# Altium schematic sheet Output_Voltage_Selection_and_Enable.SchDoc
size A4; CompanyName: Technische Hochschule Nürnberg Georg Simon Ohm; Organization: UltraZohm; Address1: Kesslerplatz 12; Address2: 90489 Nürnberg; Address3: GERMANY; DocumentNumber: 5; SheetNumber: 5; SheetTotal: 5; Website: www.ultrazohm.com
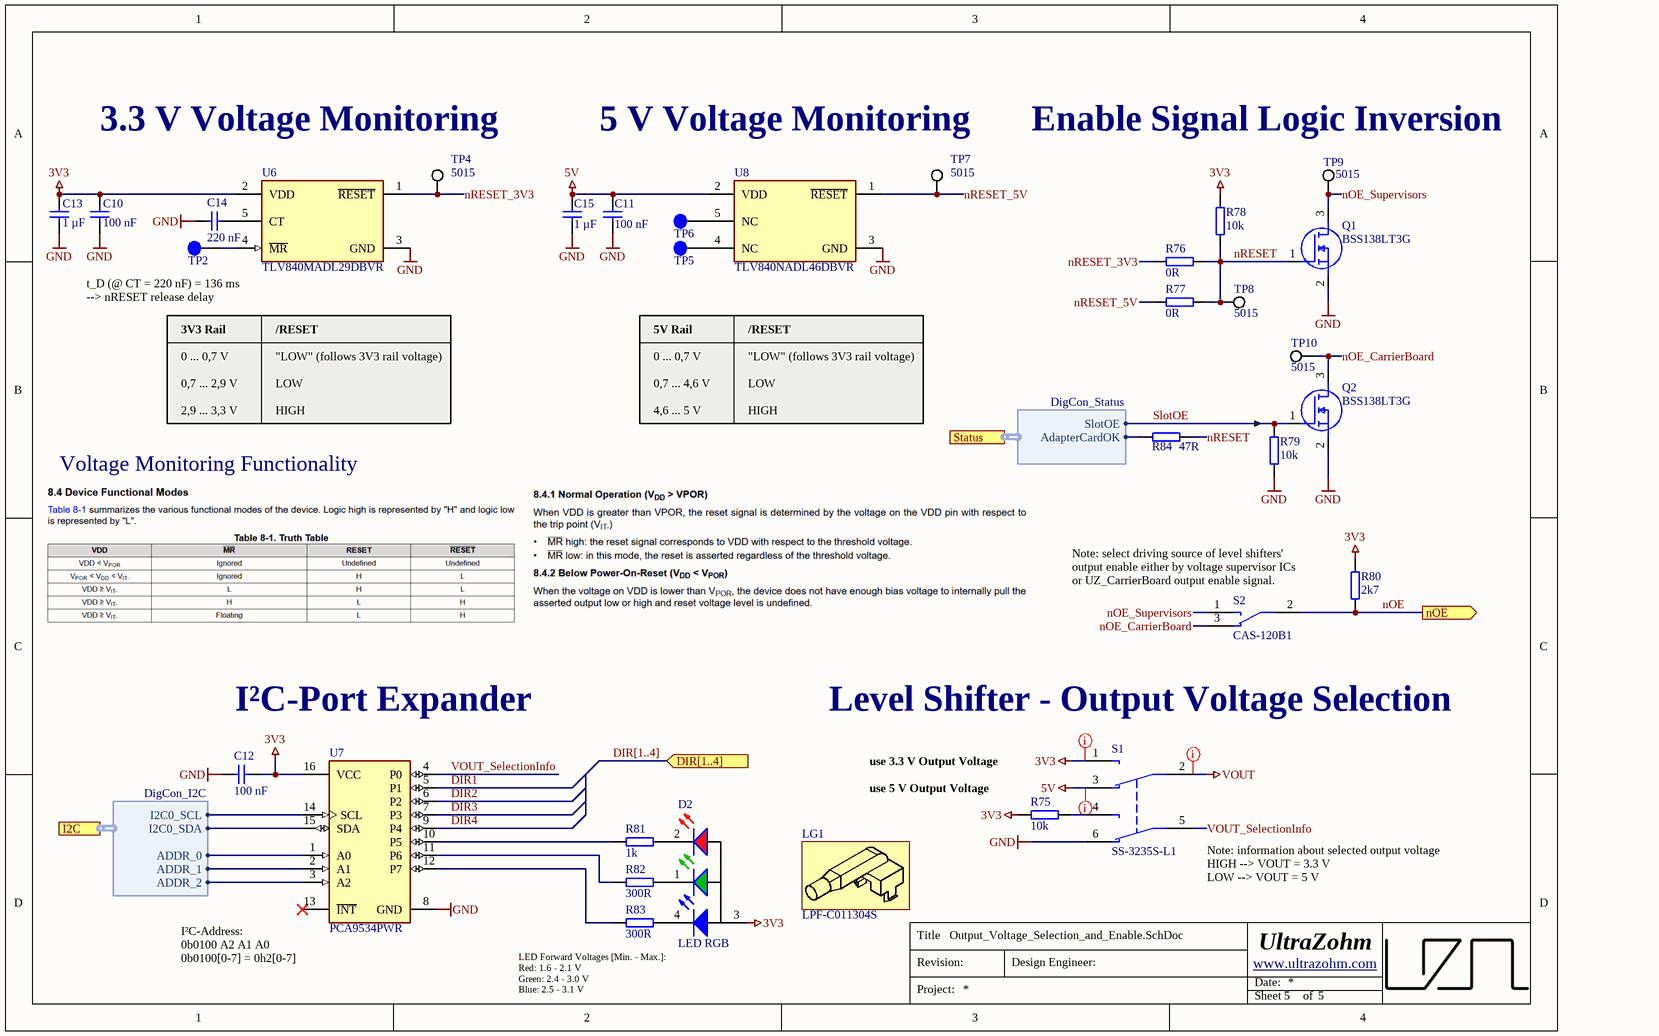
[diagram p0: Output_Voltage_Selection_and_Enable.SchDoc]

## Parts
C10  100 nF  [C_0603_TE]
C11  100 nF  [C_0603_TE]
C12  100 nF  [C_0603_TE]
C13  1 µF  [C_0603_TE]
C14  220 nF  [C_0603_TE]
C15  1 µF  [C_0603_TE]
D2  LED RGB  [LED_1615]
LG1  LPF-C011304S  [LPF-C011304S]
Q1  BSS138LT3G  [SOT-23-3]
Q2  BSS138LT3G  [SOT-23-3]
R75  10k  [R_0603_TE]
R76  0R  [R_0603_TE]
R77  0R  [R_0603_TE]
R78  10k  [R_0603_TE]
R79  10k  [R_0603_TE]
R80  2k7  [R_0603_TE]
R81  1k  [R_0603_TE]
R82  300R  [R_0603_TE]
R83  300R  [R_0603_TE]
R84  47R  [R_0603_TE]
S1  SS-3235S-L1  [SS-3235S-L1]
S2  CAS-120B1  [CAS120B1]
TP2  Testpoint 1mm  [TP_1mm]  (value not drawn)  (no BOM)
TP4  5015  [FP-5015-MFG]
TP5  Testpoint 1mm  [TP_1mm]  (value not drawn)  (no BOM)
TP6  Testpoint 1mm  [TP_1mm]  (value not drawn)  (no BOM)
TP7  5015  [FP-5015-MFG]
TP8  5015  [FP-5015-MFG]
TP9  5015  [FP-5015-MFG]
TP10  5015  [FP-5015-MFG]
U6  TLV840MADL29DBVR  [SOT23-5_DBV]
U7  PCA9534PWR  [TSSOP-16_PW0016A_N]
U8  TLV840NADL46DBVR  [SOT23-5_DBV]

## Ports
DIR[1..4] (in), I2C (harness DigCon_I2C), nOE (out), Status (harness DigCon_Status)

## Harnesses
DigCon_Status: SlotOE, AdapterCardOK
DigCon_I2C: I2C0_SDA, I2C0_SCL, ADDR_0, ADDR_1, ADDR_2

## Nets
3V3: C10.1 C12.2 C13.2 D2.3(A) R75.2 R78.2 R80.2 S1.1(NO1) U6.2(VDD) U7.16(VCC)
5V: C11.1 C15.2 S1.3(NC1) U8.2(VDD)
GND: C10.2 C11.2 C12.1 C13.1 C14.1 C15.1 Q1.2(S) Q2.2(S) R79.1 S1.6(NC2) U6.3(GND) U7.8(GND) U8.3(GND)
VOUT: S1.2(COM1)
DIR1: U7.5(P1)
DIR2: U7.6(P2)
DIR3: U7.7(P3)
DIR4: U7.9(P4)
nOE: R80.1 S2.2(COM1) ; port nOE
nOE_CarrierBoard: Q2.3(D) S2.3(NC1) TP10.1
nOE_Supervisors: Q1.3(D) S2.1(NO1) TP9.1
nRESET: Q1.1(G) R76.2 R77.2 R78.1 R84.2 TP8.1
nRESET_3V3: R76.1 TP4.1 U6.1(~{RESET})
nRESET_5V: R77.1 TP7.1 U8.1(~{RESET})
SlotOE: Q2.1(G) R79.2 ; port Status.SlotOE
VOUT_SelectionInfo: S1.5(COM2) U7.4(P0)
NetC14_2: C14.2 U6.5(CT)
NetD2_1: D2.1(K) R82.2
NetD2_2: D2.2(K) R81.1
NetD2_4: D2.4(K_B) R83.2
NetR75_1: R75.1 S1.4(NO2)
NetR81_2: R81.2 U7.10(P5)
NetR82_1: R82.1 U7.11(P6)
NetR83_1: R83.1 U7.12(P7)
NetR84_1: R84.1 ; port Status.AdapterCardOK
NetTP2_1: TP2.1 U6.4(~{MR})
NetTP5_1: TP5.1 U8.4(NC)
NetTP6_1: TP6.1 U8.5(NC)
NetU7_1: U7.1(A0) ; port I2C.ADDR_0
NetU7_2: U7.2(A1) ; port I2C.ADDR_1
NetU7_3: U7.3(A2) ; port I2C.ADDR_2
NetU7_14: U7.14(SCL) ; port I2C.I2C0_SCL
NetU7_15: U7.15(SDA) ; port I2C.I2C0_SDA

Not connected (* = marked no-connect by the designer): U7 13(~{INT})*

## Buses and harness runs
bus DIR[1..4] = port DIR[1..4]

## Layout directives
mark named PWR: 3V3, 5V, VOUT

## Notes on the sheet
- 3.3 V Voltage Monitoring
- 5 V Voltage Monitoring
- (near TP9) Enable Signal Logic Inversion
- t_D (@ CT = 220 nF) = 136 ms
  --> nRESET release delay
- 3V3 Rail
- 0 ... 0,7 V
- 0,7 ... 2,9 V
- /RESET
- "LOW" (follows 3V3 rail voltage)
- LOW
- 5V Rail
- 0,7 ... 4,6 V
- 2,9 ... 3,3 V
- HIGH
- 4,6 ... 5 V
- Voltage Monitoring Functionality
- (near S2) Note: select driving source of level shifters' output enable either by voltage supervisor ICs or UZ_CarrierBoard output enable signal.
- I²C-Port Expander
- Level Shifter - Output Voltage Selection
- (near R75) use 3.3 V Output Voltage
- (near R75) use 5 V Output Voltage
- (near S1) Note: information about selected output voltage
  HIGH --> VOUT = 3.3 V
  LOW --> VOUT = 5 V
- (near U7) I²C-Address:
  0b0100 A2 A1 A0
  0b0100[0-7] = 0h2[0-7]
- LED Forward Voltages [Min. - Max.]:
  Red: 1.6 - 2.1 V
  Green: 2.4 - 3.0 V
  Blue: 2.5 - 3.1 V
- Title
- Revision:
- Design Engineer:
- Date:
- Project:
- Sheet
- of

## Library data of the parts
C10 C11 = UZgen_C_0603_100nF_50V_X7R: Generic capacitor; Manufacturer: UZgen; Voltage: 50V; Tolerance: 10 %; Created from: AGeiger; Manufacturer Part Number: UZgen_C_0603_100nF_50V_X7R; PartID: 1; Created On: 02.07.2024 14:42:23; Value: 100 nF; Device Package: 0603; Technology: X7R; Mounting Type: SMD; Last Updated: 08.08.2024 15:01:15
C12 = UZgen_C_0603_100nF_50V_X7R: Generic capacitor; Manufacturer: UZgen; Tolerance: 10 %; Created from: AGeiger; Voltage: 50V; Manufacturer Part Number: UZgen_C_0603_100nF_50V_X7R; PartID: 1; Created On: 02.07.2024 14:42:23; Device Package: 0603; Last Updated: 08.08.2024 15:01:15; Mounting Type: SMD; Value: 100 nF; Technology: X7R
C13 C15 = UZgen_C_0603_1uF_16V_X7R: Generic capacitor; Manufacturer: UZgen; Voltage: 16V; Tolerance: 10 %; Created from: UZgenTool; Manufacturer Part Number: UZgen_C_0603_1uF_16V_X7R; PartID: 3783; Created On: 02.08.2024 11:17:59; Value: 1 µF; Device Package: 0603; Technology: X7R; Mounting Type: SMD; Last Updated: 02.08.2024 11:17:59
C14 = UZgen_C_0603_220nF_50V_X7R: Generic capacitor; Manufacturer: UZgen; Voltage: 50V; Tolerance: 10 %; Created from: UZgenTool; Manufacturer Part Number: UZgen_C_0603_220nF_50V_X7R; PartID: 2; Created On: 02.07.2024 14:42:23; Value: 220 nF; Device Package: 0603; Technology: X7R; Mounting Type: SMD; Last Updated: 08.08.2024 15:01:15
D2 = A-SP1943B1GHR6C-C01-2T: RGB LED - SMD 1615; Manufacturer: Amicc; Type: Standard; Created from: AGeiger; Manufacturer Part Number: A-SP1943B1GHR6C-C01-2T; PartID: 31; Created On: 09.09.2024 10:45:01; ComponentLink1Description: Datasheet; ComponentLink1URL: https://www.lcsc.com/datasheet/lcsc_datasheet_2410121631_Amicc-A-SP1943B1GHR6C-C01-2T_C19171342.pdf; Component Type: LED Diode; Device Package: 1615; Last Updated: 09.09.2024 10:45:01; Mounting Type: SMD; Operating Temperature: -40 to +85 °C; Supplier 1: LCSC; Supplier Part Number 1: C19171342; Value: LED RGB; Live Cycle Status: 1; Stock number: not stored; Color: rgb; LCSC Part Number: C19171342
LG1 = LPF-C011304S: LED Light Pipes RA Light Pipe Clr 2.8mm Round; Manufacturer: Lumex; Created from: AGeiger; Manufacturer Part Number: LPF-C011304S; PartID: 54; Created On: 15.07.2024 08:35:38; ComponentLink1Description: Datasheet; ComponentLink1URL: https://www.farnell.com/datasheets/1632591.pdf; Component Type: Light Guide; Device Package: SMD; Last Updated: 22.03.2025 18:11:56; Mounting Type: SMD; Supplier 1: Mouser; Supplier Part Number 1: 696-LPF-C011304S; Type: Lightguide; Value: LPF-C011304S; Live Cycle Status: 1
Q1 Q2 = BSS138LT3G: Power MOSFET, n-Channel, 200 mA, 50 V; Manufacturer: ON Semicondutor; Value: 50 V; Created from: MGremer; Manufacturer Part Number: BSS138LT3G; PartID: 1; Created On: 02.02.2021 13:34:18; ComponentLink1Description: Datasheet; ComponentLink1URL: https://www.mouser.de/datasheet/2/308/BSS138LT1_D-1522521.pdf; Component Type: Power MOSFET; Device Package: SOT-23-3; Last Updated: 28.03.2025 21:09:28; Mounting Type: SMD; Operating Temperature: -55 - 150 °C; Series: BSS138L; Supplier 1: Mouser; Supplier Part Number 1: 863-BSS138LT3G; Type: Power MOSFET; Live Cycle Status: 1; Stock number: not stored; Supplier 2: LCSC; Supplier Part Number 2: C83790; LCSC Part Number: C83790
R75 R78 R79 = UZgen_R_0603_10k: Generic resistor; Manufacturer: UZgen; Tolerance: 1 %; Created from: AGeiger; Manufacturer Part Number: UZgen_R_0603_10k; PartID: 1; Created On: 02.07.2024 14:34:53; Value: 10k; Device Package: 0603; Mounting Type: SMD; Last Updated: 02.07.2024 14:37:16
R76 R77 = UZgen_R_0603_0R: Generic resistor; Manufacturer: UZgen; Tolerance: 1 %; Created from: UZgenTool; Manufacturer Part Number: UZgen_R_0603_0R; PartID: 581; Created On: 08.07.2024 14:34:30; Value: 0R; Device Package: 0603; Mounting Type: SMD; Last Updated: 08.07.2024 14:34:30
R80 = UZgen_R_0603_2k7: Generic resistor; Manufacturer: UZgen; Tolerance: 1 %; Created from: UZgenTool; Manufacturer Part Number: UZgen_R_0603_2k7; PartID: 231; Created On: 02.07.2024 17:29:49; Value: 2k7; Device Package: 0603; Mounting Type: SMD; Last Updated: 02.07.2024 17:29:49
R81 = UZgen_R_0603_1k: Generic resistor; Manufacturer: UZgen; Tolerance: 1 %; Created from: UZgenTool; Manufacturer Part Number: UZgen_R_0603_1k; PartID: 221; Created On: 02.07.2024 17:29:49; Value: 1k; Device Package: 0603; Mounting Type: SMD; Last Updated: 02.07.2024 17:29:49
R82 R83 = UZgen_R_0603_300R: Generic resistor; Manufacturer: UZgen; Tolerance: 1 %; Created from: UZgenTool; Manufacturer Part Number: UZgen_R_0603_300R; PartID: 208; Created On: 02.07.2024 17:29:49; Value: 300R; Device Package: 0603; Mounting Type: SMD; Last Updated: 02.07.2024 17:29:49
R84 = UZgen_R_0603_47R: Generic resistor; Manufacturer: UZgen; Tolerance: 1 %; Created from: UZgenTool; Manufacturer Part Number: UZgen_R_0603_47R; PartID: 189; Created On: 02.07.2024 17:29:48; Value: 47R; Device Package: 0603; Mounting Type: SMD; Last Updated: 02.07.2024 17:29:48
S1 = SS-3235S-L1: 50mA Horizontal attachment DPDT 12V 12V 50mA 10,000 times Black SMD Slide Switches ROHS; Manufacturer: XKB Connection; Created from: AGeiger; Manufacturer Part Number: SS-3235S-L1; PartID: 49; Created On: 21.02.2024 17:10:55; ComponentLink1Description: Datasheet; ComponentLink1URL: https://www.lcsc.com/datasheet/lcsc_datasheet_2110111230_XKB-Connection-SS-3235S-L1_C500055.pdf; Component Type: Switch DPDT; Device Package: SMD; Last Updated: 23.08.2024 11:42:29; Mounting Type: SMD; Operating Temperature: -40 to +85 °C; Supplier 1: LCSC; Supplier Part Number 1: C500055; Type: Switch; Value: DPDT; Live Cycle Status: 1; LCSC Part Number: C500055
S2 = CAS-120B1: Slide Switches SPDT, ON-ON, slide, gull wing SMD terminals, 100mA @ 6V DC, bulk packaging, non-washable without seal tape; Manufacturer: Nidec Components; Created from: AGeiger; Manufacturer Part Number: CAS-120B1; PartID: 50; Created On: 21.02.2024 17:10:55; ComponentLink1Description: Datasheet; ComponentLink1URL: https://eu.mouser.com/datasheet/2/972/cas-1628136.pdf; Component Type: Switch SPDT; Device Package: SMD; Last Updated: 22.12.2024 16:58:00; Mounting Type: SMD; Operating Temperature: -40 to +85 °C; Supplier 1: Mouser; Supplier Part Number 1: 229-CAS-120B1; Supplier 2: LCSC; Supplier Part Number 2: C3664598; Type: DIP-Switch; Value: SPDT; Live Cycle Status: 1; LCSC Part Number: C3664598
TP2 TP5 TP6 = NULL: Manufacturer Part Number: NULL; Created from: AGeiger; Created: 2018_06_25_AGeiger; Value: Testpoint 1mm; PartID: 9; Created On: 20.09.2022 13:14:57; Component Type: Testpoint; Last Updated: 20.09.2022 13:15:39; Manufacturer: NULL; Supplier 1: NULL; Supplier Part Number 1: NULL; Type: Testpoint; Live Cycle Status: 1
TP4 TP7-TP10 = 5015: Circuit Board Hardware - PCB SM TEST POINT ON T&R - MINIATURE; Manufacturer: Keystone Electronics; Value: SMD Testpoint; Created from: AGeiger; ComponentLink1Description: Datasheet; ComponentLink2URL: http://www.keyelco.com/product-pdf.cfm?p=1357; ComponentLink1URL: https://www.mouser.de/datasheet/2/215/015-744075.pdf; ComponentLink2Description: Datasheet; Manufacturer Part Number: 5015; PartID: 26; Created On: 03.06.2023 11:19:55; Component Type: Circuit Board Hardware; Device Package: SMD; Last Updated: 03.06.2023 11:43:17; Mounting Type: SMD; Supplier 1: Mouser; Supplier Part Number 1: 534-5015; Type: PCB SMD Testpoint; Live Cycle Status: 1; LCSC Part Number: C5199798
U6 = TLV840MADL29DBVR: Supervisory Circuits 2.9V Monitor; Manufacturer: Texas Instruments; Value: TLV840-29; Created from: AGeiger; Manufacturer Part Number: TLV840MADL29DBVR; PartID: 56; Created On: 16.12.2024 15:31:49; ComponentLink1Description: Datasheet; ComponentLink1URL: https://www.ti.com/lit/ds/symlink/tlv840.pdf?ts=1742949911670; Component Type: Voltage Monitor; Device Package: SOT-23-5; Last Updated: 26.03.2025 08:58:10; Mounting Type: SMD; Operating Temperature: -40 to +125 °C; Supplier 1: Mouser; Supplier Part Number 1: 595-TLV840MADL29DBVR; Supplier 2: LCSC; Supplier Part Number 2: C3687807; Type: Voltage Monitor; Live Cycle Status: 1; LCSC Part Number: C3687807
U7 = PCA9534PWR: 8-bit 2.3- to 5.5-V I2C/SMBus I/O expander with interrupt & config registers; Manufacturer: Texas Instruments; Created from: AGeiger; Manufacturer Part Number: PCA9534PWR; PartID: 6; Created On: 18.06.2024 19:29:27; ComponentLink1Description: Datasheet; ComponentLink1URL: https://www.ti.com/lit/gpn/pca9534; Component Type: I2C-IO-Expander; Device Package: TSSOP-16; Last Updated: 18.07.2024 09:13:25; Mounting Type: SMD; Supplier 1: Mouser; Supplier Part Number 1: 771-PCAL9539APW118; Supplier 2: LCSC; Supplier Part Number 2: 595-PCA9534PWR; Type: I2C IO Expander; Live Cycle Status: 1; LCSC Part Number: C133803; Stock number: not stored
U8 = TLV840NADL46DBVR: Supervisory Circuits 4.6V Monitor; Manufacturer: Texas Instruments; Value: TLV840-46; Created from: AGeiger; Manufacturer Part Number: TLV840NADL46DBVR; PartID: 57; Created On: 16.12.2024 15:31:49; ComponentLink1Description: Datasheet; ComponentLink1URL: https://www.ti.com/lit/ds/symlink/tlv840.pdf?ts=1742949911670; Component Type: Voltage Monitor; Device Package: SOT-23-5; Last Updated: 26.03.2025 08:58:10; Mounting Type: SMD; Operating Temperature: -40 to +125 °C; Supplier 1: Mouser; Supplier Part Number 1: 595-TLV840NADL46DBVR; Supplier 2: LCSC; Supplier Part Number 2: C2870132; Type: Voltage Monitor; Live Cycle Status: 1; LCSC Part Number: C2870132